# EAGLE design Heizung (EAGLE 7.3.0)
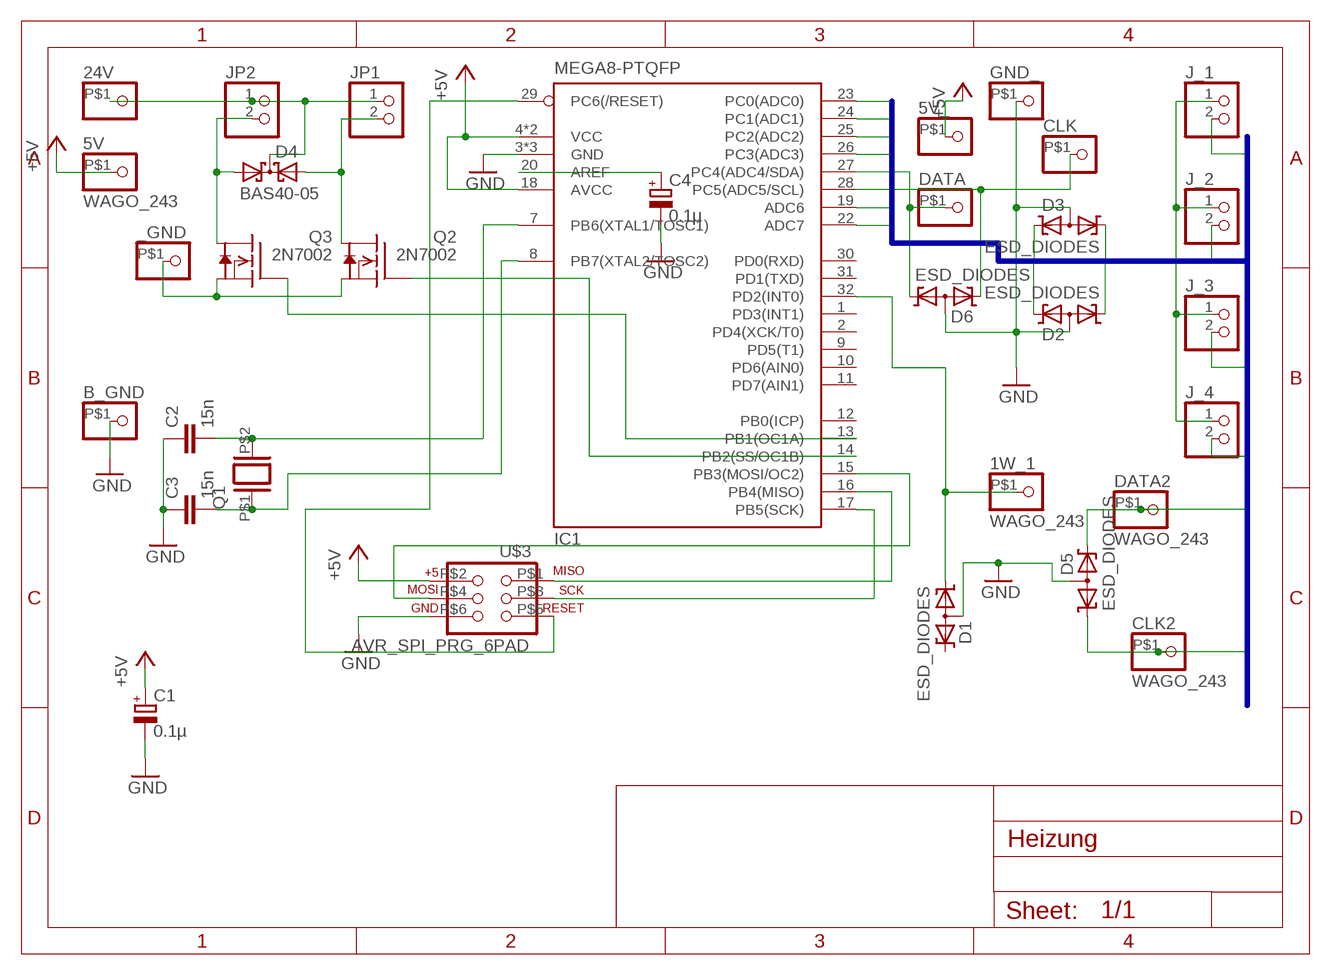
[diagram p0: schematic, sheet 1]

## Parts
1W_1  WAGO_243  [WAGO_243]
5V  WAGO_243  [WAGO_243]
5V_  WAGO_243  [WAGO_243]
24V  WAGO_243  [WAGO_243]
_GND  WAGO_243  [WAGO_243]
B_GND  WAGO_243  [WAGO_243]
C1  0.1µ  CP1206  [CP1206]
C2  15n  CC0603  [C0603]
C3  15n  CC0603  [C0603]
C4  0.1µ  CP1206  [CP1206]
CLK  WAGO_243  [WAGO_243]
CLK2  WAGO_243  [WAGO_243]
D1  ESD_DIODES  [SOT23]
D2  ESD_DIODES  [SOT23]
D3  ESD_DIODES  [SOT23]
D4  BAS40-05  [SOT23]
D5  ESD_DIODES  [SOT23]
D6  ESD_DIODES  [SOT23]
DATA  WAGO_243  [WAGO_243]
DATA2  WAGO_243  [WAGO_243]
GND_  WAGO_243  [WAGO_243]
IC1  MEGA8-PTQFP  [TQFP32-08]
J_1  PINHD-1X2LEVER  [1X02_GN]
J_2  PINHD-1X2LEVER  [1X02_GN]
J_3  PINHD-1X2LEVER  [1X02_GN]
J_4  PINHD-1X2LEVER  [1X02_GN]
JP1  PINHD-1X2LEVER  [1X02_GN]
JP2  PINHD-1X2LEVER  [1X02_GN]
Q1  XTALSMD5  [Q_SMD5]
Q2  2N7002  [SOT23]
Q3  2N7002  [SOT23]
U$3  AVR_SPI_PRG_6PAD  [2X3_PAD]

## Nets
+5V [wires]: 5V.P$1 5V_.P$1 C1.+ IC1.4(VCC) IC1.6(VCC) IC1.18(AVCC) U$3.P$2
B1: D2.2(K2) IC1.23(PC0(ADC0)) J_1.2
B2: D2.1(K1) IC1.24(PC1(ADC1)) J_2.2
B3: D3.1(K1) IC1.25(PC2(ADC2)) J_3.2
B4: D3.2(K2) IC1.26(PC3(ADC3)) J_4.2
B5: D5.2(K2) DATA2.P$1 IC1.19(ADC6)
B6: CLK2.P$1 D5.1(K1) IC1.22(ADC7)
GND [wires]: B_GND.P$1 C1.- C2.1 C3.1 C4.- D1.3(AA) D2.3(AA) D3.3(AA) D5.3(AA) D6.3(AA) GND_.P$1 IC1.3(GND) IC1.5(GND) IC1.21(GND) J_1.1 J_2.1 J_3.1 J_4.1 U$3.P$6
GND24 [p24]: _GND.P$1 Q2.2(S) Q3.2(S)
N$1 [p24]: 24V.P$1 D4.3(C) JP1.1 JP2.1
N$3: IC1.14(PB2(SS/OC1B)) Q2.1(G)
N$4: IC1.15(PB3(MOSI/OC2)) U$3.P$4
N$5: 1W_1.P$1 D1.1(K1) IC1.32(PD2(INT0))
N$6: C2.2 IC1.7(PB6(XTAL1/TOSC1)) Q1.P$2
N$7: IC1.17(PB5(SCK)) U$3.P$3
N$10: D6.1(K1) DATA.P$1 IC1.27(PC4(ADC4/SDA))
N$18: CLK.P$1 D6.2(K2) IC1.28(PC5(ADC5/SCL))
N$19 [p24]: D4.2(A2) JP1.2 Q2.3(D)
N$29: C3.2 IC1.8(PB7(XTAL2/TOSC2)) Q1.P$1
N$33 [p24]: D4.1(A1) JP2.2 Q3.3(D)
N$35: IC1.16(PB4(MISO)) U$3.P$1
N$37: IC1.29(PC6(/RESET)) U$3.P$5
N$40: IC1.13(PB1(OC1A)) Q3.1(G)
N$41: C4.+ IC1.20(AREF)
Unconnected: D1.2(K2) IC1.1(PD3(INT1)) IC1.2(PD4(XCK/T0)) IC1.9(PD5(T1)) IC1.10(PD6(AIN0)) IC1.11(PD7(AIN1)) IC1.12(PB0(ICP)) IC1.30(PD0(RXD)) IC1.31(PD1(TXD))

## Buses
B1,B2,B3,B4,B5,B6

## Library data of the parts
1W_1 5V 5V_ 24V _GND B_GND CLK CLK2 DATA DATA2 GND_ = common:WAGO_243
C1 C4 = common:CP: POLARIZED CAPACITOR, European symbol
C2 C3 = common:C
D1-D3 D5 D6 = common:ESD_DIODES: ESD Diodes
D4 = common:BAS40-05: Silicon Schottky Diodes General-purpose diode for high-speed switching
IC1 = common:MEGA8-P: MICROCONTROLLER 8 Kbytes FLASH, 1 kbytes SRAM, 512 bytes EEPROM, USART, 4-channel 10 bit ADC, 2-channel 8 bit ADC Pin compatible with Atmega48, ATMega88, ATMega168 Source: avr.lbr
J_1-J_4 JP1 JP2 = common:PINHD-1X2: PIN HEADER
Q1 = common:XTAL: CRYSTAL
Q2 Q3 = common:2N7002: N-Channel Enhancement MOSFET 60 V; 115 mA; 1.2…14 Ohm
U$3 = common:AVR_SPI_PRG_6: AVR ISP 6 Pin This is the reduced ISP connector for AVR programming. Common on Arduino. This footprint will take up less PCB space and can be used with a 10-pin to 6-pin adapter such as SKU: BOB-08508

## Net classes
0 default: width 0.35 mm
1 wires: width 0.5 mm, clearance 0.35 mm
2 p24: width 1 mm, clearance 0.4 mm

## Board
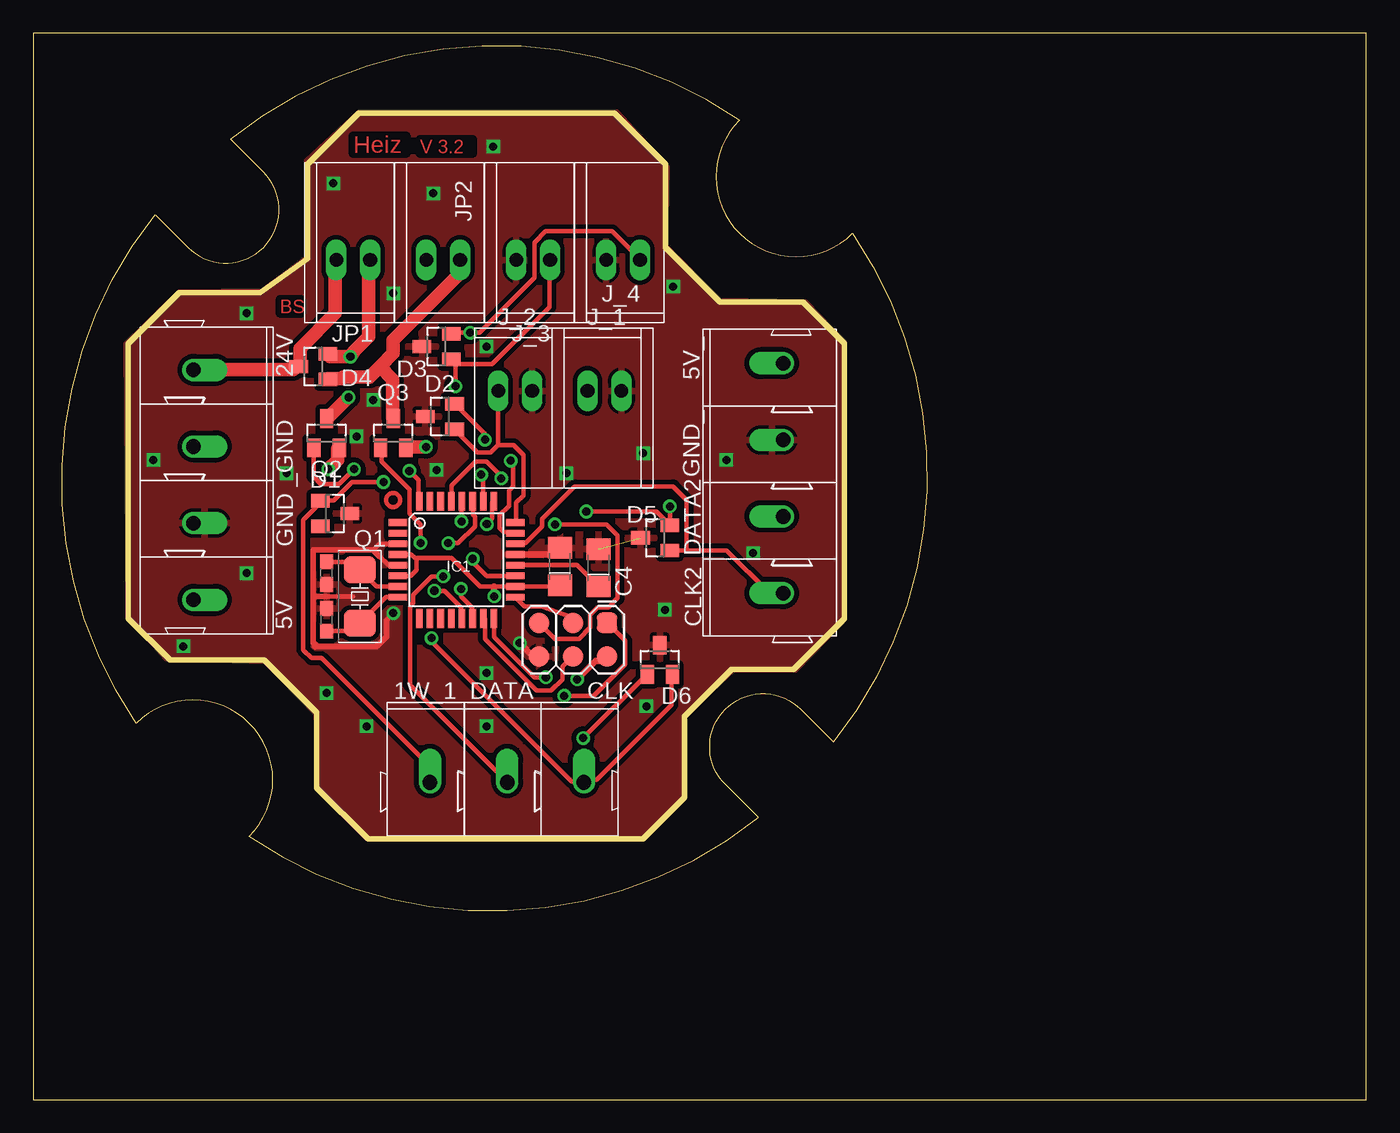
[diagram p1: board, top side]
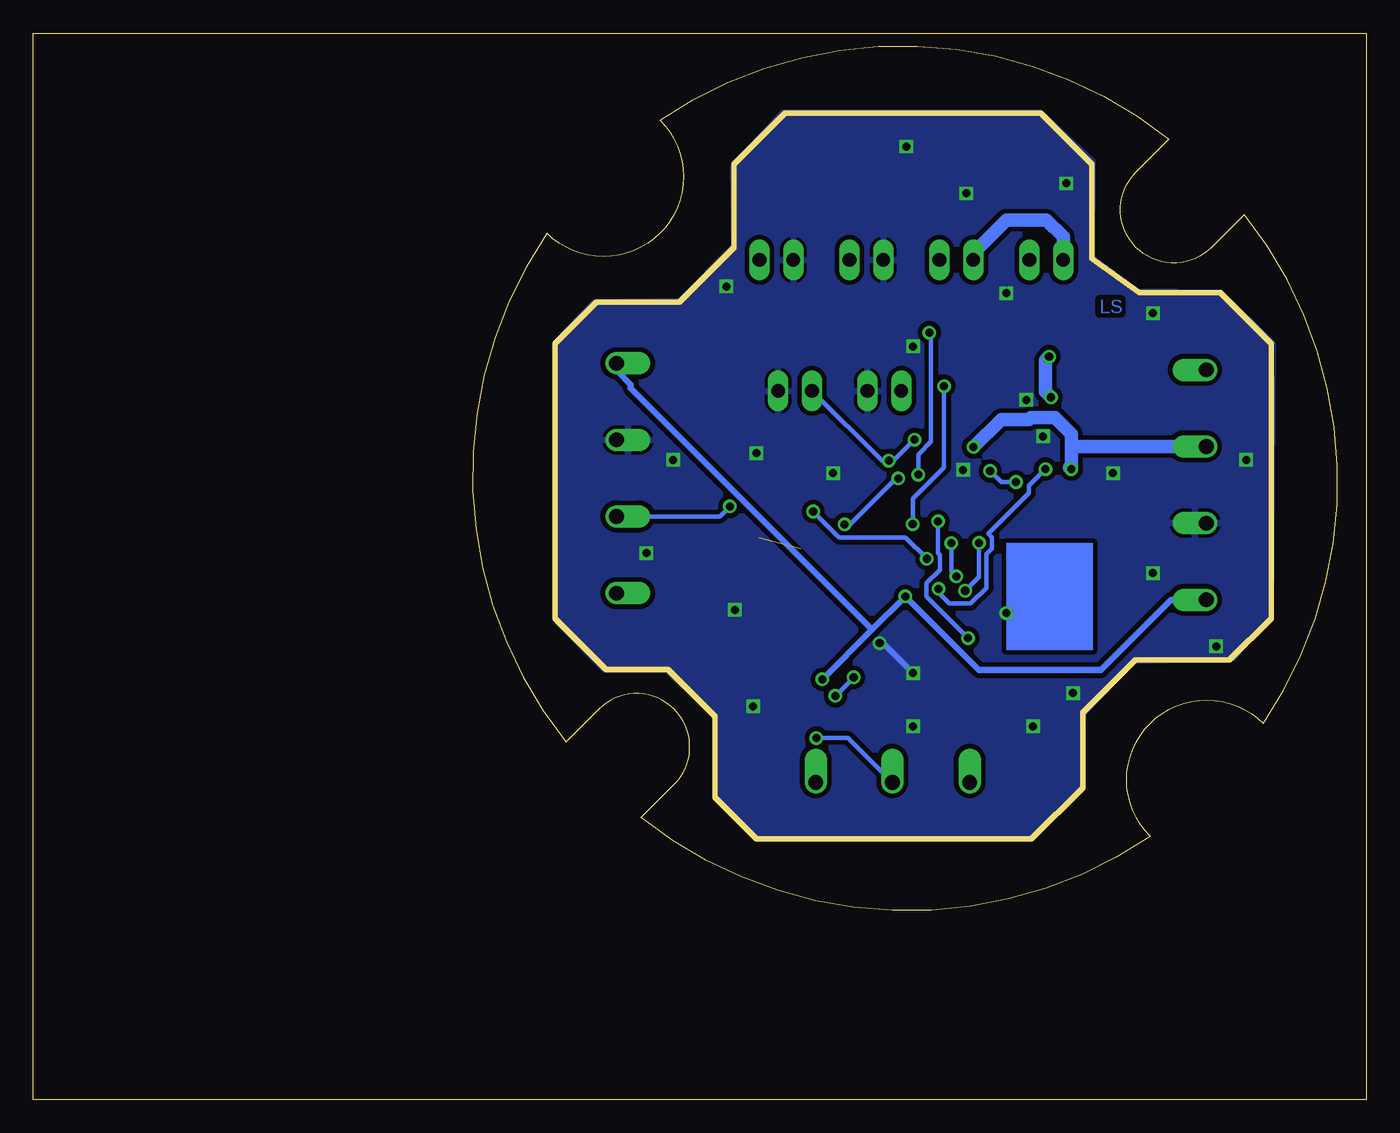
[diagram p2: board, bottom side, seen from below]

Size 100 x 80 mm. Coordinates in mm from the lower left corner, seen from the top.
Outline: 0,0 100,0 100,80 0,80 0,0
Outline: 10.25,32.98 17.32,32.98 21.27,29.03 21.27,23.37 25.1,19.54 45.73,19.54 48.85,22.66 48.85,28.74 52.38,32.27 57.04,32.27 60.87,36.1 60.87,56.73 57.75,59.85 51.51,59.85 47.44,63.92 47.44,70.16 43.61,73.99 24.39,73.99 20.57,70.16 20.57,63.09 17.03,60.56 10.96,60.56 7.13,56.73 7.13,36.1 10.25,32.98
Copper layers (1*16): Top 0.035mm / dielectric 1.5mm / Bottom 0.035mm
Design rules "default *": minimum track width 0.35mm, minimum drill 24mil, track to track 8mil, track to pad 8mil, pad to pad 8mil, via to via 8mil, smd to smd 8mil, copper to edge 0mil, drill to drill 8mil, minimum pad ring 10mil, minimum via ring 8mil, stop-mask expansion 4mil, vias tented up to drill 0mil, thermal gap 10mil
bRestrict: area 21,34.2 to 26.5,41.2

### Footprints (pad centres in the part's own frame; a part is rotated, then mirrored left to right if it is on the bottom)
WAGO_243 = drill 1.1 pad 1.7 offset: P$1 0,0
CP1206 = smd 1.6 x 1.8: + 1.4,0; - -1.4,0
C0603 = smd 1.1 x 1: 1 -0.85,0; 2 0.85,0
SOT23 = smd 1 x 1.4: 1 -0.95,-1.1; 2 0.95,-1.1; 3 0,1.1
TQFP32-08 = smd 1.4 x 0.5: 1 -4.4,2.8; 2 -4.4,2; 3 -4.4,1.2; 4 -4.4,0.4; 5 -4.4,-0.4; 6 -4.4,-1.2; 7 -4.4,-2; 8 -4.4,-2.8; 17 4.4,-2.8; 18 4.4,-2; 19 4.4,-1.2; 20 4.4,-0.4; 21 4.4,0.4; 22 4.4,1.2; 23 4.4,2; 24 4.4,2.8 | smd 0.5 x 1.4: 9 -2.8,-4.4; 10 -2,-4.4; 11 -1.2,-4.4; 12 -0.4,-4.4; 13 0.4,-4.4; 14 1.2,-4.4; 15 2,-4.4; 16 2.8,-4.4; 25 2.8,4.4; 26 2,4.4; 27 1.2,4.4; 28 0.4,4.4; 29 -0.4,4.4; 30 -1.2,4.4; 31 -2,4.4; 32 -2.8,4.4
1X02_GN = drill 1.016 long: 1 -1.27,0; 2 1.27,0
Q_SMD5 = smd 2 x 2.4: P$1 2,0; P$2 -2,0
2X3_PAD = smd 1.524 x 1.524: P$1 -2.54,-1.27; P$2 -2.54,1.27; P$3 0,-1.27; P$4 0,1.27; P$5 2.54,-1.27; P$6 2.54,1.27

### Placement (x,y rotation side)
1W_1  29.75,23.8 90 top
5V  12,37.5 0 top
5V_  56.25,55.25 180 top
24V  12,54.75 0 top
_GND  12,49 0 top
B_GND  12,43.25 0 top
C1  39.5,40 270 top
C2  22,39.5 90 top
C3  22,36 270 top
C4  42.4,39.9 270 top
CLK  41.3,23.8 90 top
CLK2  56.25,38 180 top
D1  22.64,43.97 270 top
D2  30.5,51.25 90 top
D3  30.25,56.5 90 top
D4  21,55 90 top
D5  46.65,42.15 90 top
D6  47,33 0 top
DATA  35.55,23.8 90 top
DATA2  56.25,43.75 180 top
GND_  56.25,49.5 180 top
IC1  31.75,40.5 0 top
J_1  42.85,53.17 180 top
J_2  36.15,53.17 180 top
J_3  37.5,63 0 top
J_4  44.25,63 0 top
JP1  24,63 0 top
JP2  30.75,63 0 top
Q1  24.5,37.75 270 top
Q2  22,50 0 top
Q3  27,50 0 top
U$1  [UNTERPUTZDOSE]  34.59,46.61 45 top
U$3  40.5,34.5 180 top

### Tracks (layer width: path | path; a pad name or v marks a point on that pad's centre or on a via)
+5V  (via drill 0.61)
  Top 0.35: IC1.6 28.3,39.3 28.75,39.75 28.75,40.5 28.62,40.62 | 28.62,40.62 28.35,40.9 IC1.4 | 39.75,38.35 C1.+ 39.5,38.5 IC1.18 34.58,38.5 33.5,38.5 31.38,40.62 28.62,40.62
  Top 0.5: 42.87,33.05 U$3.P$2 | 43.29,33.19 U$3.P$2 | v40.8,31.53 42.18,32.91 42.73,32.91 U$3.P$2 | 34.58,38.5 v34.58,37.76
  Bottom 0.5: 37.06,35.27 v34.58,37.76 29.04,32.22 19.91,32.22 14.64,37.5 5V.P$1 | 37.06,35.27 v40.8,31.53 | 37.06,35.27 55.18,53.38 55.18,53.66 56.15,54.63 56.15,55.18 5V_.P$1
B1  (via drill 0.61)
  Top 0.35: IC1.23 36.1,42.6 35.27,42.6 34.99,42.87 34.99,43.84 35.68,44.53 35.68,45.68 36,46 36,47.76 v35.82,47.94 | v33.88,49.51 33.88,49.93 31.67,52.14 D2.2
  Bottom 0.35: v33.88,49.51 35.46,47.94 v35.82,47.94 36.34,47.94 J_1.2
B2
  Top 0.35: 34.85,49.1 34.3,48.54 33.33,48.54 31.67,50.2 D2.1 | 34.85,49.1 34.85,53.11 J_2.2 | 34.85,49.1 36.04,49.1 36.79,48.35 36.79,45.33 36.23,44.78 36.23,43.43 IC1.24
B3  (via drill 0.61)
  Top 0.35: 31.35,55.65 D3.1 | v31.67,53.52 31.67,55.18 31.39,55.46 D3.1 | J_3.2 38.72,62.93 38.72,59.47 34.44,55.18 31.81,55.18 D3.1 | v34.02,43.18 34.44,43.59 34.44,44.81 34.5,44.88 IC1.25
  Bottom 0.35: v34.02,43.18 34.02,45.09 31.67,47.44 v31.67,53.52
B4  (via drill 0.61)
  Top 0.35: 31.3,57.45 D3.2 31.39,57.53 v32.78,57.53 33.47,57.53 37.62,61.68 37.62,64.31 38.45,65.14 43.43,65.14 45.5,63.06 J_4.2 | v33.61,46.88 33.74,46.74 33.74,44.95 IC1.26
  Bottom 0.35: v33.61,46.88 33.61,48.41 32.64,49.37 32.64,57.4 v32.78,57.53
B5  (via drill 0.6, 0.61)
  Top 0.35: v41.49,44.12 46.74,44.12 47.71,43.15 D5.2 | IC1.19 36.1,39.28 34.02,39.28 32.97,40.33 v32.97,40.58 | 47.85,43.15 D5.2 | D5.2 47.5,43.35 47.75,43.6 v47.75,44.5
  Bottom 0.35: v41.49,44.12 39.55,42.18 34.58,42.18 v32.97,40.58 | DATA2.P$1 48.5,43.75 v47.75,44.5
B6
  Top 0.35: IC1.22 36.23,41.77 36.93,41.77 38.17,43.01 38.17,43.56 40.61,46 48,46 49,45 49,41.2 | 56.29,38.03 CLK2.P$1 56.15,38.03 55.18,38.03 52.01,41.2 49,41.2 | 49,41.2 D5.1
GND  (via drill 0.6, 0.61)  (1 unrouted)
  Top 0.35: 25,41.25 25.5,41.25 25.95,41.7 IC1.3 | IC1.5 26.65,40.1 26,40.75 | 22,37.75 24,37.75
  Top 0.406: 21,37.75 21,41.25 25.5,41.25 26,40.75 | 21,37.75 21,34.25 21.14,34 25.75,34 26.5,34.75 26.5,36 v27,36.5 | 21,37.75 22,37.75
  Top 0.5: 21.14,34.16 21.14,34 | IC1.21 39,40.9 C1.- | v36.5,34.25 37.5,33.25 37.88,33.25 U$3.P$6
  Bottom 0.5: v36.5,34.25 36.25,34.25 v34,32
  other vias: 16,59 16,39.5 24.25,49.75 34,56.5 47.38,36.75 48,61 27,60.5 22.5,68.75 34,28 22,30.5 19,47 9,48 52,48 34.5,71.5 30,68 45.75,48.5 11.25,34 40,47 54,41 25,28 46,29.5 30.25,47.25 25.5,52.5
  pour Top: 48.63,22.67 48.57,28.58 52.5,32.28 57.19,32.28 60.62,35.83 60.78,56.82 57.94,59.78 51.5,59.92 47.41,64.02 47.51,69.96 43.8,74.05 24.43,74.04 20.55,70.44 20.57,63.15 17.2,60.62 10.96,60.54 7.02,56.7 7.16,36.33 9.96,33.14 17.4,32.9 21.25,28.95 21.49,23.55 25.43,19.61 45.68,19.76
  pour Bottom: 48.63,22.67 48.57,28.58 52.5,32.28 57.19,32.28 60.62,35.83 60.78,56.82 57.94,59.78 51.5,59.92 47.41,64.02 47.51,69.96 43.8,74.05 24.43,74.04 20.55,70.44 20.57,63.15 17.2,60.62 10.96,60.54 7.02,56.7 7.16,36.33 9.96,33.14 17.4,32.9 21.25,28.95 21.49,23.55 25.43,19.61 45.68,19.76
GND24  (via drill 0.61)
  Top 1: v22.13,47.3 22.82,47.99 22.82,48.82 Q2.2 | v29.46,48.96 28.07,48.96 Q3.2
  Bottom 1: 22.27,47.44 v22.13,47.3 22.13,49 | v29.46,48.96 27.38,51.03 25.31,51.03 25.17,51.17 23.37,51.17 22.13,49.93 22.13,49 | _GND.P$1 22.13,49
N$1
  Top 1: JP1.1 22.64,62.91 22.64,59 20,56.36 20,55.48 D4.3 19.5,54.77 12.12,54.77 24V.P$1
  Bottom 1: JP1.1 22.73,64.73 24,66 27,66 29.48,63.52 JP2.1
N$3  (via drill 0.61)
  Top 0.35: v24.06,47.3 22.96,46.19 21.57,46.19 21.02,46.74 21.02,48.82 Q2.1 | v32.09,38.31 32.09,37.76 32.91,36.93 32.91,36.23 IC1.14
  Bottom 0.35: v24.06,47.3 25.31,46.05 25.31,45.5 28.35,42.46 28.07,42.18 28.07,41.35 28.49,40.94 28.49,38.39 29.68,37.2 31.26,37.2 32.09,38.03 v32.09,38.31
N$4
  Top 0.254: 33.83,36.1 IC1.15
  Top 0.35: IC1.15 33.88,36.1 33.88,34.58 37.76,30.7 38.86,30.7 39.69,31.53 39.69,32.5 40.38,33.19 U$3.P$4
N$5  (via drill 0.61)
  Top 0.35: v28.21,47.16 28.91,46.47 28.91,44.95 IC1.32 | v26.28,46.33 23.93,46.33 22.54,44.95 21.71,44.95 D1.1 21.5,44.75 20.25,43.5 20.25,33.75 20.88,33.12 21.62,33.12 29.75,25 1W_1.P$1
  Bottom 0.35: v28.21,47.16 27.38,46.33 v26.28,46.33
N$6
  Top 0.35: C2.2 23.9,40.35 Q1.P$2 25.75,38.5 IC1.7
N$7
  Top 0.254: 40.46,35.78 U$3.P$3
  Top 0.35: 40.46,35.78 40.46,36.16 38.12,37 36.85,37 IC1.17
N$10  (via drill 0.61)
  Top 0.35: v31.12,41.75 31.88,41.75 33.12,43 33.12,43.75 33,43.88 33,44.88 IC1.27 | v30.75,39.25 29.88,39.25 28.5,37.88 28.5,37.25 28.25,37 28.25,31.12 35.5,23.88 DATA.P$1 | v41.25,27.12 46,31.88 D6.1
  Bottom 0.35: v31.12,41.75 31.12,39.62 v30.75,39.25 | v41.25,27.12 38.88,27.12 DATA.P$1
N$18  (via drill 0.61)
  Top 0.35: v32.12,43.38 32.12,44.88 IC1.28 | v29.88,34.62 29.88,34.38 40.38,23.88 41.25,23.88 CLK.P$1 41.38,24 42.25,24 47.88,29.62 47.88,31.88 D6.2
  Bottom 0.35: v32.12,43.38 32.12,41 32,40.88 32,39.75 33,38.75 33,37.75 v29.88,34.62
N$19  (via drill 0.61)
  Top 1: v23.65,52.69 22.13,51.17 Q2.3 | D4.2 22.13,55.87 22.27,55.73 v23.79,55.73 24.06,56.15 25.17,57.26 25.17,62.9 JP1.2
  Bottom 1: v23.65,52.69 24.06,53.11 24.06,55.46 v23.79,55.73
N$29
  Top 0.35: C3.2 23.9,35.15 Q1.P$1 26.45,37.7 IC1.8
N$33  (via drill 0.6 pad 0.35)
  Top 1: D4.1 22.13,54.08 23.1,54.08 23.23,54.21 25.21,54.21 26,55 26.97,54.03 26.97,51.17 Q3.3 | JP2.2 32.09,63.03 v32,63
  Top 1.016: 26,55 27,56 27,57 32,62 v32,63
N$35  (via drill 0.61)
  Top 0.35: v38.45,31.67 37.62,31.67 34.58,34.71 34.58,36.1 IC1.16 | v39.83,30.29 42.04,30.29 44.39,32.64 44.39,34.44 43.15,35.68 U$3.P$1
  Bottom 0.35: v39.83,30.29 v38.45,31.67
N$37  (via drill 0.61)
  Top 0.35: v39.14,43.15 43.01,43.15 43.84,42.32 43.84,37.62 43.15,36.93 42.32,36.93 41.77,36.37 41.77,35.41 40.94,34.58 39.14,34.58 38.03,35.68 U$3.P$5 | IC1.29 31.39,44.95 31.39,46.05 33.19,47.85 34.02,47.85 35.1,46.77 v35.1,46.61
  Bottom 0.35: v39.14,43.15 38.72,43.15 35.27,46.61 v35.1,46.61
N$40  (via drill 0.61)
  Top 0.254: 32.12,36.22 IC1.13
  Top 0.35: v29.04,41.77 29.04,43.15 28.21,43.98 28.21,45.78 26.14,47.85 26.14,48.82 Q3.1 | IC1.13 32.09,36.23 32.09,36.93 30.84,38.17 v30.09,38.17
  Bottom 0.35: v29.04,41.77 29.04,39.22 v30.09,38.17
N$41
  Top 0.35: IC1.20 40.8,40.1 C4.+
(copper drawn outside any net)
  shapes: Bottom area x1, Top circle x1

### Text on the board
Top: Heiz | V 3.2 | BS
Bottom: LS
tPlace: GND